# EAGLE design EMG (EAGLE 6.5.0)
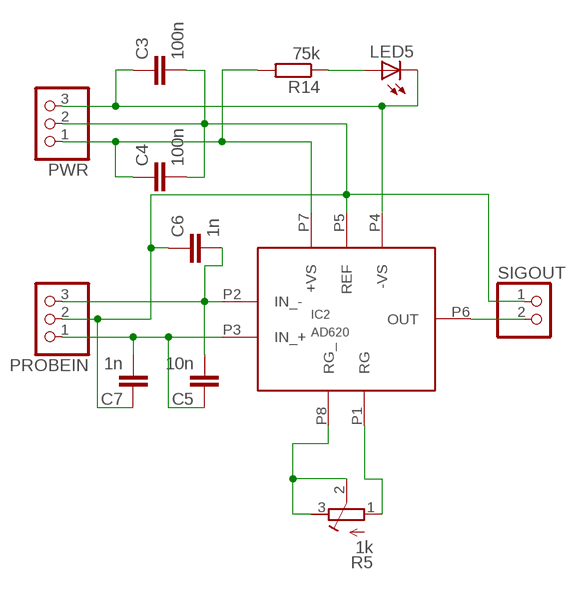
[diagram p0: schematic, sheet 1]

## Parts
C3  100n  C-EU050-025X075  [C050-025X075]
C4  100n  C-EU050-025X075  [C050-025X075]
C5  10n  C-EU050-025X075  [C050-025X075]
C6  1n  C-EU050-024X044  [C050-024X044]
C7  1n  C-EU050-024X044  [C050-024X044]
IC2  AD620  [DIL8]
LED5  LED3MM  [LED3MM]
PROBEIN  PINHD-1X3  [1X03]
PWR  PINHD-1X3  [1X03]
R5  1k  R-TRIMM64X  [RTRIM64X]
R14  75k  R-EU_0207/5V  [0207/5V]
SIGOUT  PINHD-1X2  [1X02]

## Nets
N$2: IC2.P8(RG_) R5.2(S) R5.3(E)
N$10: IC2.P1(RG) R5.1(A)
N$11: C5.1 C7.2 IC2.P3(IN_+) PROBEIN.1
N$12: C5.2 C6.2 IC2.P2(IN_-) PROBEIN.3
N$13: C3.2 C4.2 C6.1 C7.1 IC2.P5(REF) PROBEIN.2 PWR.2 SIGOUT.1
N$14: C3.1 IC2.P4(-VS) LED5.K(C) PWR.3
N$15: C4.1 IC2.P7(+VS) PWR.1 R14.2
N$16: IC2.P6(OUT) SIGOUT.2
N$36: LED5.A R14.1

## Library data of the parts
C3-C7 = rcl:C-EU: CAPACITOR, European symbol
IC2 = ad620:AD620
LED5 = led:LED: LED OSRAM: - CHIPLED LG R971, LG N971, LY N971, LG Q971, LY Q971, LO R971, LY R971 LH N974, LH R974 LS Q976, LO Q976, LY Q976 LO Q996 - Hyper CHIPLED LW Q18S LB Q993, LB Q99A, LB R99A - SideLED LS A670, LO A670, LY A670, LG A670, LP A670 LB A673, LV A673, LT A673, LW A673 LH A674 LY A675 LS A676, LA A676, LO A676, LY A676, LW A676 LS A679, LY A679, LG A679 - Hyper Micro SIDELED® LS Y876, LA Y876, LO Y876, LY Y876 LT Y87S - SmartLED LW L88C, LW L88S LB L89C, LB L89S, LG L890 LS L89K, LO L89K, LY L89K LS L896, LA L896, LO L896, LY L896 - TOPLED LS T670, LO T670, LY T670, LG T670, LP T670 LSG T670, LSP T670, LSY T670, LOP T670, LYG T670 LG T671, LOG T671, LSG T671 LB T673, LV T673, LT T673, LW T673 LH T674 LS T676, LA T676, LO T676, LY T676, LB T676, LH T676, LSB T676, LW T676 LB T67C, LV T67C, LT T67C, LS T67K, LO T67K, LY T67K, LW E67C LS E67B, LA E67B, LO E67B, LY E67B, LB E67C, LV E67C, LT E67C LW T67C LS T679, LY T679, LG T679 LS T770, LO T770, LY T770, LG T770, LP T770 LB T773, LV T773, LT T773, LW T773 LH T774 LS E675, LA E675, LY E675, LS T675 LS T776, LA T776, LO T776, LY T776, LB T776 LHGB T686 LT T68C, LB T68C - Hyper Mini TOPLED® LB M676 - Mini TOPLED Santana® LG M470 LS M47K, LO M47K, LY M47K Source: http://www.osram.convergy.de LUXEON: - LUMILED® LXK2-PW12-R00, LXK2-PW12-S00, LXK2-PW14-U00, LXK2-PW14-V00 LXK2-PM12-R00, LXK2-PM12-S00, LXK2-PM14-U00 LXK2-PE12-Q00, LXK2-PE12-R00, LXK2-PE12-S00, LXK2-PE14-T00, LXK2-PE14-U00 LXK2-PB12-K00, LXK2-PB12-L00, LXK2-PB12-M00, LXK2-PB14-N00, LXK2-PB14-P00, LXK2-PB14-Q00 LXK2-PR12-L00, LXK2-PR12-M00, LXK2-PR14-Q00, LXK2-PR14-R00 LXK2-PD12-Q00, LXK2-PD12-R00, LXK2-PD12-S00 LXK2-PH12-R00, LXK2-PH12-S00 LXK2-PL12-P00, LXK2-PL12-Q00, LXK2-PL12-R00 Source: www.luxeon.com KINGBRIGHT: KA-3528ASYC Source: www.kingbright.com
PROBEIN PWR = pinhead:PINHD-1X3: PIN HEADER
R5 = rcl:R-TRIMM: Trimm resistor
R14 = rcl:R-EU_: RESISTOR, European symbol
SIGOUT = pinhead:PINHD-1X2: PIN HEADER

## Board
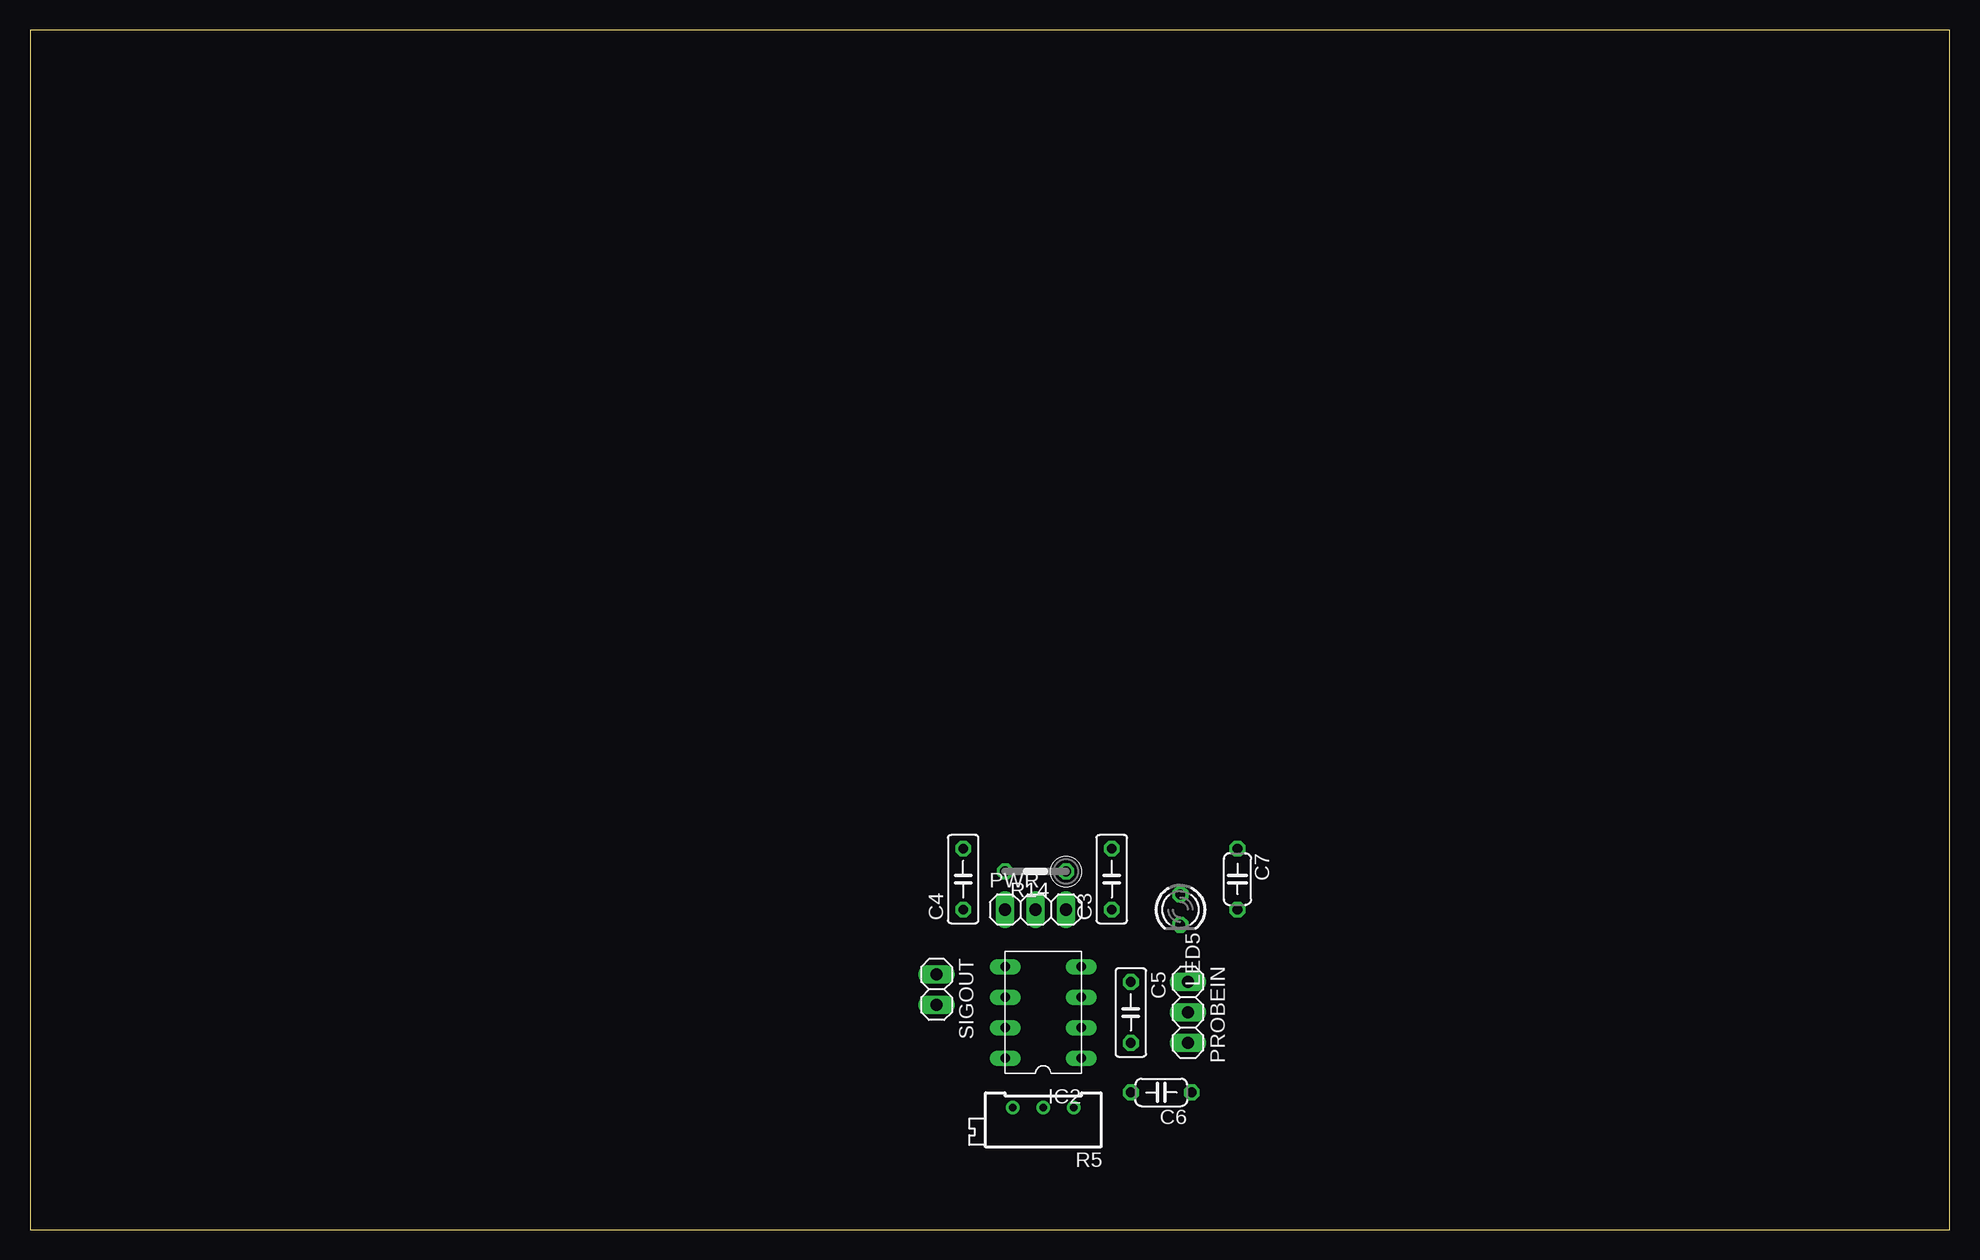
[diagram p1: board, top side]
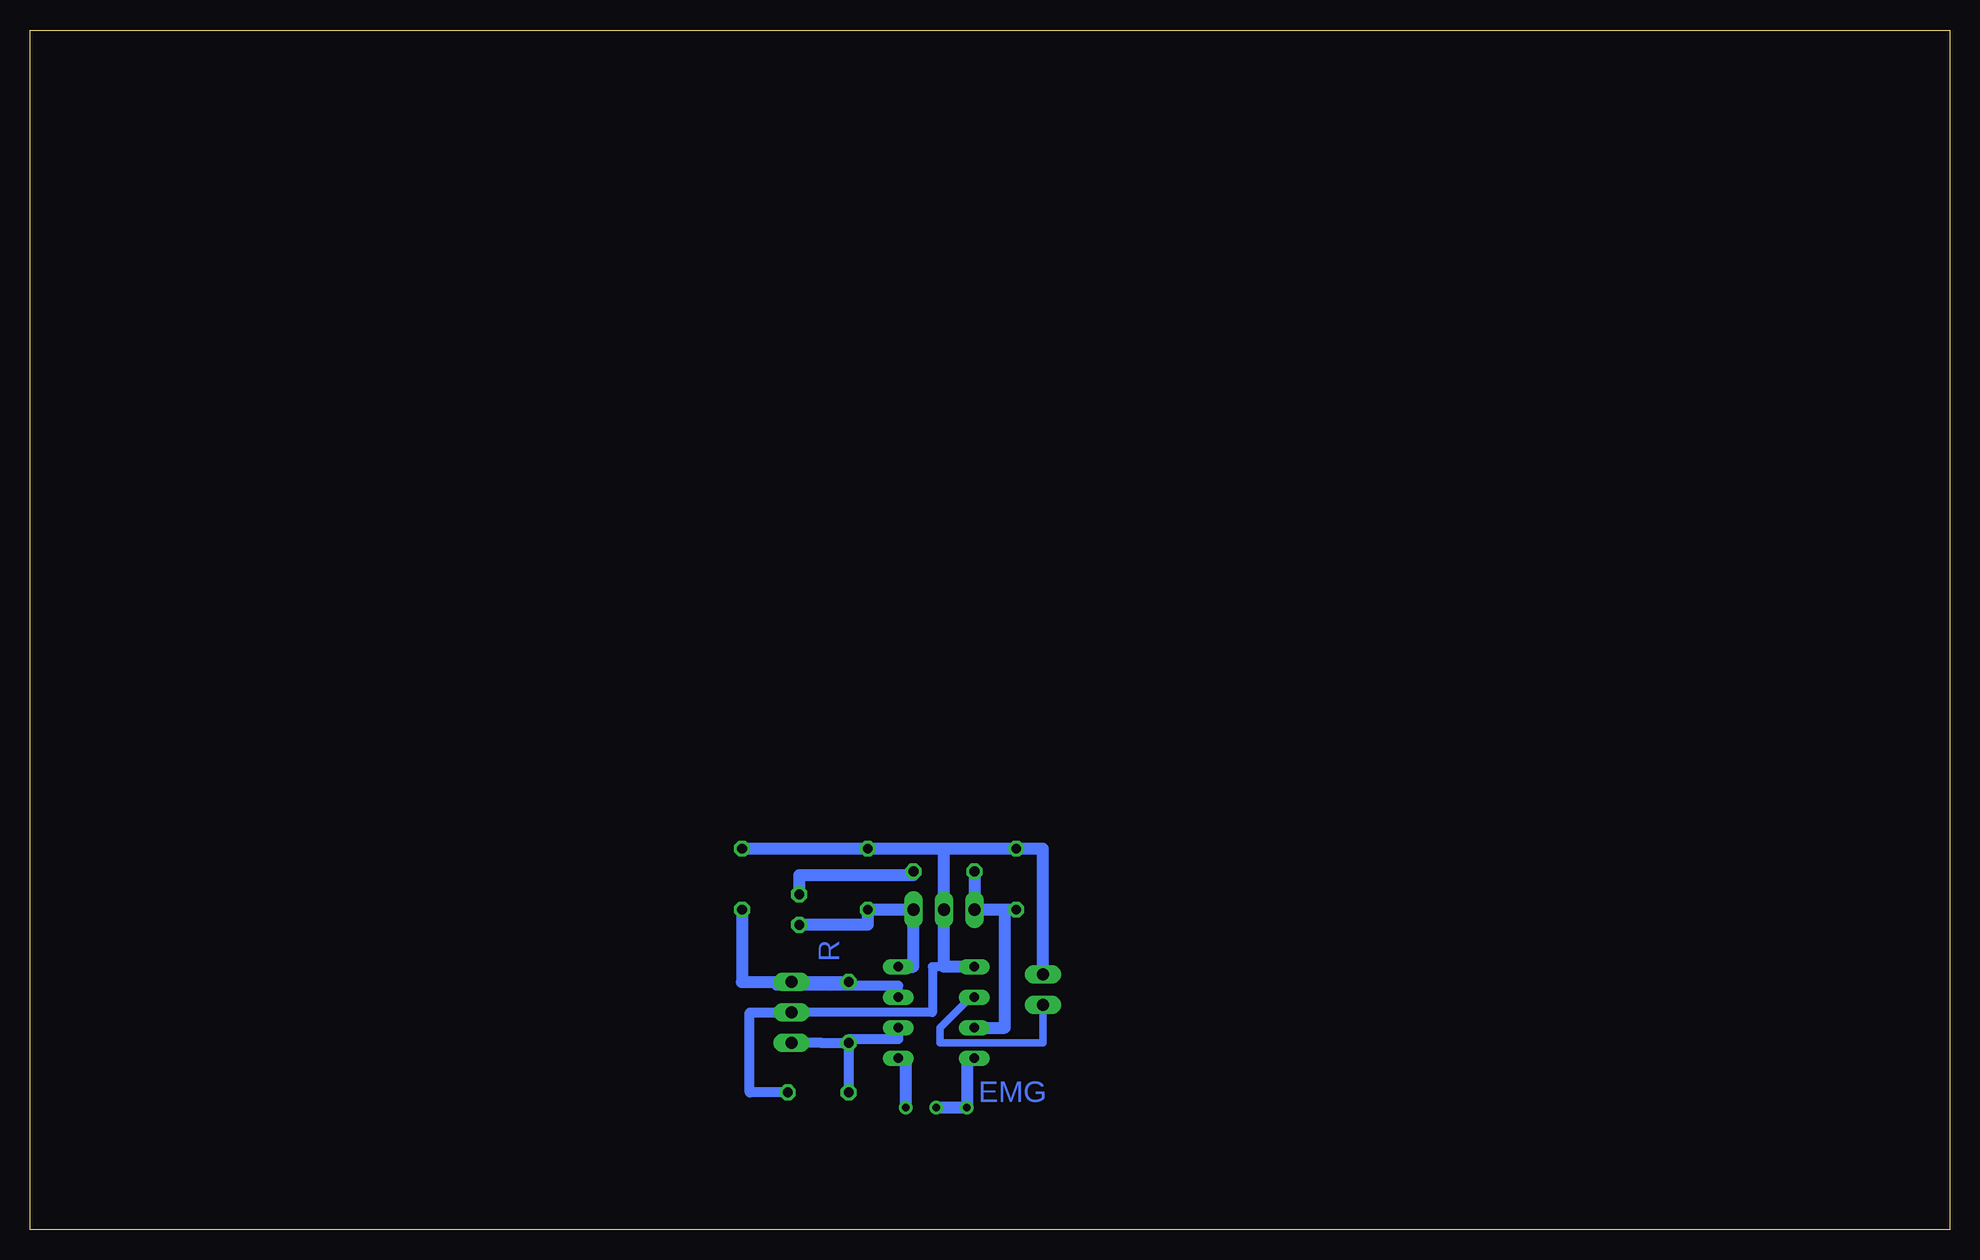
[diagram p2: board, bottom side, seen from below]

Size 160 x 100 mm. Coordinates in mm from the lower left corner, seen from the top.
Outline: 0,0 160,0 160,100 0,100 0,0
Copper layers (1*16): Top 0.035mm / dielectric 1.5mm / Bottom 0.035mm
Design rules "default": minimum track width 10mil, minimum drill 24mil, track to track 8mil, track to pad 8mil, pad to pad 8mil, via to via 8mil, smd to smd 8mil, copper to edge 40mil, drill to drill 8mil, minimum pad ring 10mil, minimum via ring 8mil, stop-mask expansion 4mil, vias tented up to drill 0mil, thermal gap 10mil

### Footprints (pad centres in the part's own frame; a part is rotated, then mirrored left to right if it is on the bottom)
C050-025X075 = drill 0.813 octagon: 1 -2.54,0; 2 2.54,0
C050-024X044 = drill 0.813 octagon: 1 -2.54,0; 2 2.54,0
DIL8 = drill 0.8 long: P1 -3.81,2.54; P2 -1.27,2.54; P3 1.27,2.54; P4 3.81,2.54; P5 3.81,8.89; P6 1.27,8.89; P7 -1.27,8.89; P8 -3.81,8.89
LED3MM = drill 0.813 octagon: A -1.27,0; K 1.27,0
1X03 = drill 1.016 long: 1 -2.54,0; 2 0,0; 3 2.54,0
RTRIM64X = drill 0.61: 1 1.27,-2.54; 2 1.27,0; 3 1.27,2.54
0207/5V = drill 0.813 octagon: 1 -2.54,0; 2 2.54,0
1X02 = drill 1.016 long: 1 -1.27,0; 2 1.27,0

### Placement (x,y rotation side)
C3  90.17,29.21 90 top
C4  77.79,29.21 90 top
C5  91.76,18.1 270 top
C6  94.3,11.43 180 top
C7  100.65,29.21 270 top
IC2  90.17,18.1 90 top
LED5  95.89,26.67 270 top
PROBEIN  96.52,18.1 270 top
PWR  83.82,26.67 0 top
R5  84.45,8.89 90 top
R14  83.82,29.84 180 top
SIGOUT  75.56,20 270 top

### Tracks (layer width: path | path; a pad name or v marks a point on that pad's centre or on a via)
N$2
  Bottom 1.016: IC2.P8 81.92,14.29 R5.3 R5.2
N$10
  Bottom 1.016: R5.1 87,14.29 IC2.P1
N$11
  Bottom 0.254: 92.39,20.32 95.25,20.34 | 95.25,20.34 PROBEIN.1 | 97.16,20.32 95.25,20.32 95.25,20.34 | 100.65,20.64 97.16,20.32 | 97.16,20.32 C5.1
  Bottom 0.813: IC2.P3 87.63,20.32 92.39,20.32 93.34,20.32 | 93.34,20.32 C5.1 | 93.34,20.32 97.16,20.32 97.79,20.32
  Bottom 1.016: C7.2 100.65,20.64 PROBEIN.1 C5.1
N$12
  Bottom 0.254: 93.98,15.56 91.76,15.88 PROBEIN.3 93.34,15.56
  Bottom 0.406: 93.98,15.56 87.63,15.88
  Bottom 0.813: IC2.P2 87.63,15.88 91.76,15.88 C5.2 | PROBEIN.3 93.98,15.56 93.34,15.56 C5.2 | C5.2 C6.2
N$13
  Bottom 0.254: 75.56,20.95 SIGOUT.1
  Bottom 0.61: 84.77,21.91 83.82,21.91
  Bottom 0.762: PROBEIN.2 84.77,18.1 84.77,21.91 83.5,21.91
  Bottom 0.813: 75.56,31.75 C4.2 83.82,31.75 PWR.2 83.82,21.91 | C6.1 100.01,11.43 100.01,18.1 PROBEIN.2
  Bottom 1.016: SIGOUT.1 75.56,31.75 83.82,31.75 | 83.82,31.75 C3.2 C7.1 | IC2.P5 83.5,21.91 83.82,21.91 83.82,31.75
N$14
  Bottom 1.016: 87.95,21.91 IC2.P4 86.36,21.91 PWR.3 C3.1 90.17,25.4 LED5.K
N$15
  Bottom 0.254: 80.96,16.83 IC2.P7
  Bottom 0.813: 80.96,16.83 78.74,16.83
  Bottom 1.016: 78.74,26.67 PWR.1 R14.2 | 78.74,26.67 C4.1 | IC2.P7 78.74,16.83 78.74,26.67
N$16
  Bottom 0.61: IC2.P6 81.6,19.37 84.14,16.83 84.14,15.56 75.56,15.56 SIGOUT.2
N$36
  Bottom 1.016: R14.1 86.36,29.53 95.89,29.53 LED5.A

### Text on the board
Bottom: R | EMG